# Altium schematic sheet Sheet1.SchDoc
size A3
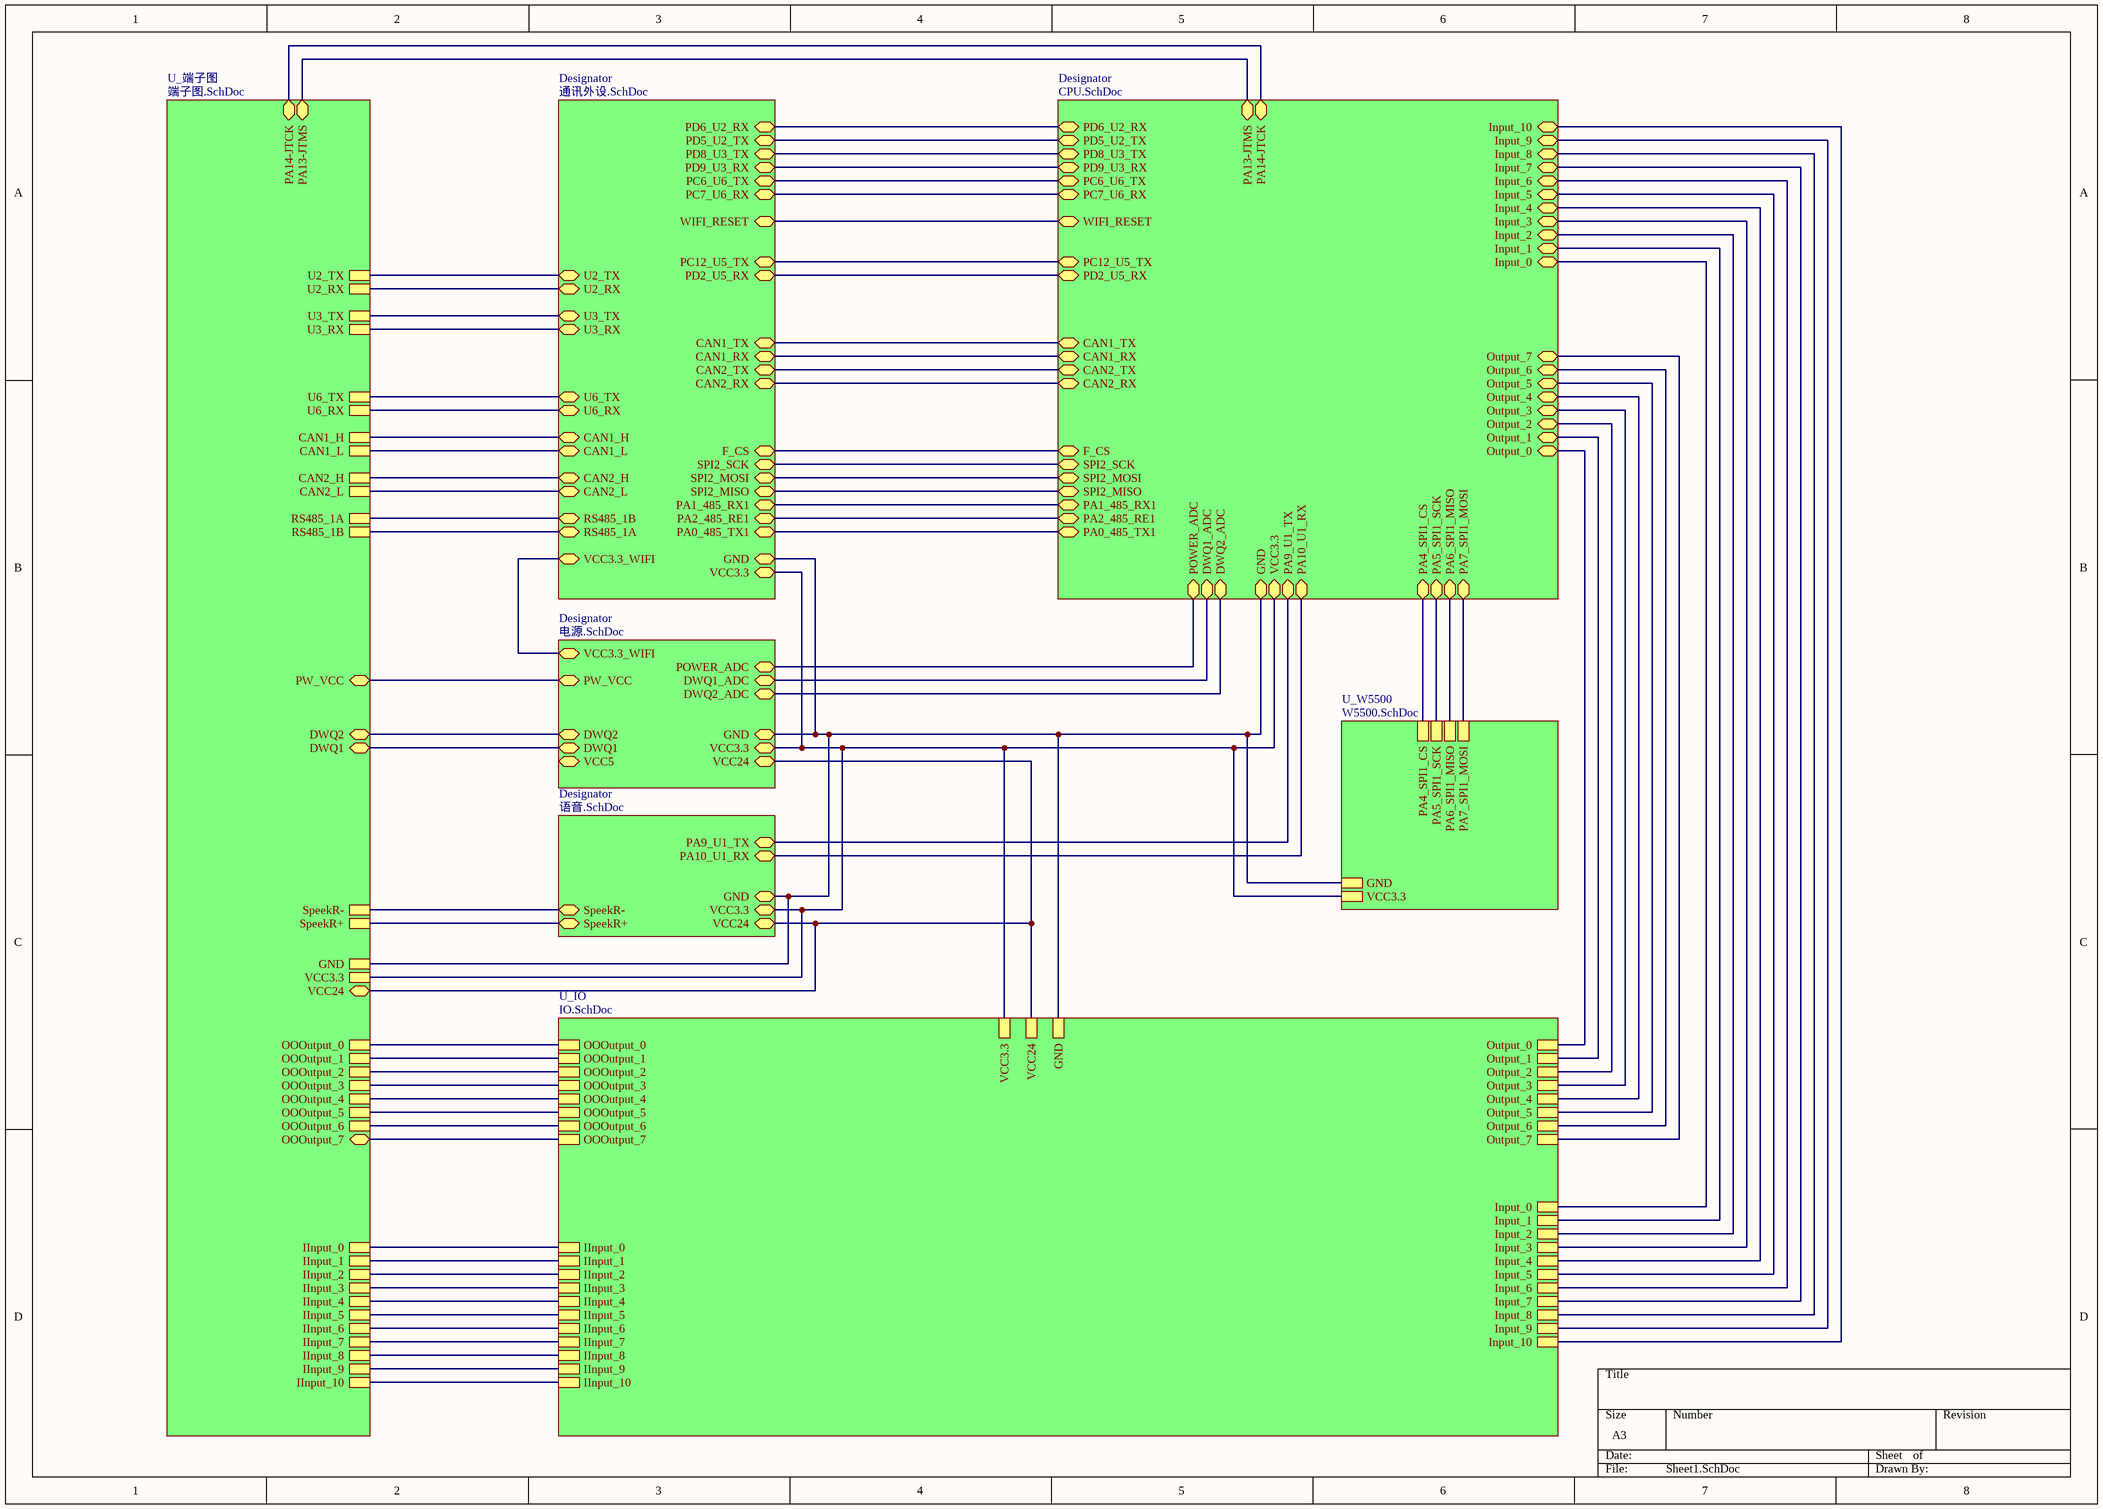
[diagram p0: Sheet1.SchDoc]

## Sub-sheets
Designator = CPU.SchDoc: PD8_U3_TX, PD9_U3_RX, PD5_U2_TX, PD6_U2_RX, PD2_U5_RX, PC12_U5_TX, PC6_U6_TX, PC7_U6_RX, DWQ1_ADC, DWQ2_ADC, SPI2_SCK, SPI2_MISO, SPI2_MOSI, F_CS, CAN2_RX, CAN2_TX, CAN1_RX, CAN1_TX, PA0_485_TX1, PA1_485_RX1, PA2_485_RE1, PA9_U1_TX, PA10_U1_RX, VCC3.3, GND, POWER_ADC, Input_0, Input_1, Input_2, Input_3, Input_4, Input_5, Input_6, Input_7, Input_8, Input_9, Input_10, Output_0, Output_1, Output_2, Output_3, Output_4, Output_5, Output_6, Output_7, PA4_SPI1_CS, PA5_SPI1_SCK, PA6_SPI1_MISO, PA7_SPI1_MOSI, PA13-JTMS, PA14-JTCK, WIFI_RESET
Designator = 通讯外设.SchDoc: PD6_U2_RX, PD5_U2_TX, PD8_U3_TX, PD9_U3_RX, PC6_U6_TX, PC7_U6_RX, U2_TX, U2_RX, U3_TX, U3_RX, PC12_U5_TX, PD2_U5_RX, U6_TX, U6_RX, CAN1_TX, CAN1_RX, CAN2_TX, CAN2_RX, CAN1_H, CAN1_L, CAN2_H, CAN2_L, F_CS, SPI2_SCK, SPI2_MOSI, SPI2_MISO, PA1_485_RX1, PA2_485_RE1, PA0_485_TX1, RS485_1B, RS485_1A, VCC3.3, GND, VCC3.3_WIFI, WIFI_RESET
Designator = 语音.SchDoc: SpeekR-, SpeekR+, PA9_U1_TX, PA10_U1_RX, VCC3.3, VCC24, GND
Designator = 电源.SchDoc: VCC3.3, VCC24, VCC5, GND, DWQ1_ADC, DWQ2_ADC, DWQ1, DWQ2, POWER_ADC, PW_VCC, VCC3.3_WIFI
U_IO = IO.SchDoc: VCC3.3, VCC24, GND, Input_0, Input_1, Input_2, Input_3, Input_4, Input_5, Input_6, Input_7, Input_8, Input_9, Input_10, IInput_0, IInput_1, IInput_2, IInput_3, IInput_4, IInput_5, IInput_6, IInput_7, IInput_8, IInput_9, IInput_10, Output_0, Output_1, Output_2, Output_3, Output_4, Output_5, Output_6, Output_7, OOOutput_0, OOOutput_1, OOOutput_2, OOOutput_3, OOOutput_4, OOOutput_5, OOOutput_6, OOOutput_7
U_W5500 = W5500.SchDoc: PA4_SPI1_CS, PA5_SPI1_SCK, PA6_SPI1_MISO, PA7_SPI1_MOSI, VCC3.3, GND
U_端子图 = 端子图.SchDoc: SpeekR-, SpeekR+, RS485_1B, RS485_1A, CAN1_H, CAN1_L, CAN2_H, CAN2_L, U2_TX, U2_RX, U3_TX, U3_RX, U6_TX, U6_RX, IInput_0, IInput_1, IInput_2, IInput_3, IInput_4, IInput_5, IInput_6, IInput_7, IInput_8, IInput_9, IInput_10, OOOutput_0, OOOutput_1, OOOutput_2, OOOutput_3, OOOutput_4, OOOutput_5, OOOutput_6, GND, VCC3.3, DWQ1, DWQ2, PA13-JTMS, PA14-JTCK, OOOutput_7, PW_VCC, VCC24

## Nets
(unnamed): sheet Designator/PD8_U3_TX, sheet Designator/PD8_U3_TX
(unnamed): sheet Designator/PD9_U3_RX, sheet Designator/PD9_U3_RX
(unnamed): sheet Designator/PD5_U2_TX, sheet Designator/PD5_U2_TX
(unnamed): sheet Designator/PD6_U2_RX, sheet Designator/PD6_U2_RX
(unnamed): sheet Designator/PD2_U5_RX, sheet Designator/PD2_U5_RX
(unnamed): sheet Designator/PC12_U5_TX, sheet Designator/PC12_U5_TX
(unnamed): sheet Designator/PC6_U6_TX, sheet Designator/PC6_U6_TX
(unnamed): sheet Designator/PC7_U6_RX, sheet Designator/PC7_U6_RX
(unnamed): sheet Designator/DWQ1_ADC, sheet Designator/DWQ1_ADC
(unnamed): sheet Designator/DWQ2_ADC, sheet Designator/DWQ2_ADC
(unnamed): sheet Designator/SPI2_SCK, sheet Designator/SPI2_SCK
(unnamed): sheet Designator/SPI2_MISO, sheet Designator/SPI2_MISO
(unnamed): sheet Designator/SPI2_MOSI, sheet Designator/SPI2_MOSI
(unnamed): sheet Designator/F_CS, sheet Designator/F_CS
(unnamed): sheet Designator/CAN2_RX, sheet Designator/CAN2_RX
(unnamed): sheet Designator/CAN2_TX, sheet Designator/CAN2_TX
(unnamed): sheet Designator/CAN1_RX, sheet Designator/CAN1_RX
(unnamed): sheet Designator/CAN1_TX, sheet Designator/CAN1_TX
(unnamed): sheet Designator/PA0_485_TX1, sheet Designator/PA0_485_TX1
(unnamed): sheet Designator/PA1_485_RX1, sheet Designator/PA1_485_RX1
(unnamed): sheet Designator/PA2_485_RE1, sheet Designator/PA2_485_RE1
(unnamed): sheet Designator/PA9_U1_TX, sheet Designator/PA9_U1_TX
(unnamed): sheet Designator/PA10_U1_RX, sheet Designator/PA10_U1_RX
(unnamed): sheet Designator/VCC3.3, sheet Designator/VCC3.3, sheet Designator/VCC3.3, sheet Designator/VCC3.3, sheet U_W5500/VCC3.3, sheet U_IO/VCC3.3, sheet U_端子图/VCC3.3
(unnamed): sheet Designator/GND, sheet Designator/GND, sheet Designator/GND, sheet Designator/GND, sheet U_W5500/GND, sheet U_IO/GND, sheet U_端子图/GND
(unnamed): sheet Designator/POWER_ADC, sheet Designator/POWER_ADC
(unnamed): sheet Designator/Input_0, sheet U_IO/Input_0
(unnamed): sheet Designator/Input_1, sheet U_IO/Input_1
(unnamed): sheet Designator/Input_2, sheet U_IO/Input_2
(unnamed): sheet Designator/Input_3, sheet U_IO/Input_3
(unnamed): sheet Designator/Input_4, sheet U_IO/Input_4
(unnamed): sheet Designator/Input_5, sheet U_IO/Input_5
(unnamed): sheet Designator/Input_6, sheet U_IO/Input_6
(unnamed): sheet Designator/Input_7, sheet U_IO/Input_7
(unnamed): sheet Designator/Input_8, sheet U_IO/Input_8
(unnamed): sheet Designator/Input_9, sheet U_IO/Input_9
(unnamed): sheet Designator/Input_10, sheet U_IO/Input_10
(unnamed): sheet Designator/Output_0, sheet U_IO/Output_0
(unnamed): sheet Designator/Output_1, sheet U_IO/Output_1
(unnamed): sheet Designator/Output_2, sheet U_IO/Output_2
(unnamed): sheet Designator/Output_3, sheet U_IO/Output_3
(unnamed): sheet Designator/Output_4, sheet U_IO/Output_4
(unnamed): sheet Designator/Output_5, sheet U_IO/Output_5
(unnamed): sheet Designator/Output_6, sheet U_IO/Output_6
(unnamed): sheet Designator/Output_7, sheet U_IO/Output_7
(unnamed): sheet Designator/PA4_SPI1_CS, sheet U_W5500/PA4_SPI1_CS
(unnamed): sheet Designator/PA5_SPI1_SCK, sheet U_W5500/PA5_SPI1_SCK
(unnamed): sheet Designator/PA6_SPI1_MISO, sheet U_W5500/PA6_SPI1_MISO
(unnamed): sheet Designator/PA7_SPI1_MOSI, sheet U_W5500/PA7_SPI1_MOSI
(unnamed): sheet Designator/PA13-JTMS, sheet U_端子图/PA13-JTMS
(unnamed): sheet Designator/PA14-JTCK, sheet U_端子图/PA14-JTCK
(unnamed): sheet Designator/WIFI_RESET, sheet Designator/WIFI_RESET
(unnamed): sheet Designator/U2_TX, sheet U_端子图/U2_TX
(unnamed): sheet Designator/U2_RX, sheet U_端子图/U2_RX
(unnamed): sheet Designator/U3_TX, sheet U_端子图/U3_TX
(unnamed): sheet Designator/U3_RX, sheet U_端子图/U3_RX
(unnamed): sheet Designator/U6_TX, sheet U_端子图/U6_TX
(unnamed): sheet Designator/U6_RX, sheet U_端子图/U6_RX
(unnamed): sheet Designator/CAN1_H, sheet U_端子图/CAN1_H
(unnamed): sheet Designator/CAN1_L, sheet U_端子图/CAN1_L
(unnamed): sheet Designator/CAN2_H, sheet U_端子图/CAN2_H
(unnamed): sheet Designator/CAN2_L, sheet U_端子图/CAN2_L
(unnamed): sheet Designator/RS485_1B, sheet U_端子图/RS485_1A
(unnamed): sheet Designator/RS485_1A, sheet U_端子图/RS485_1B
(unnamed): sheet Designator/VCC3.3_WIFI, sheet Designator/VCC3.3_WIFI
(unnamed): sheet Designator/SpeekR-, sheet U_端子图/SpeekR-
(unnamed): sheet Designator/SpeekR+, sheet U_端子图/SpeekR+
(unnamed): sheet Designator/VCC24, sheet Designator/VCC24, sheet U_IO/VCC24, sheet U_端子图/VCC24
(unnamed): sheet Designator/DWQ1, sheet U_端子图/DWQ1
(unnamed): sheet Designator/DWQ2, sheet U_端子图/DWQ2
(unnamed): sheet Designator/PW_VCC, sheet U_端子图/PW_VCC
(unnamed): sheet U_IO/IInput_0, sheet U_端子图/IInput_0
(unnamed): sheet U_IO/IInput_1, sheet U_端子图/IInput_1
(unnamed): sheet U_IO/IInput_2, sheet U_端子图/IInput_2
(unnamed): sheet U_IO/IInput_3, sheet U_端子图/IInput_3
(unnamed): sheet U_IO/IInput_4, sheet U_端子图/IInput_4
(unnamed): sheet U_IO/IInput_5, sheet U_端子图/IInput_5
(unnamed): sheet U_IO/IInput_6, sheet U_端子图/IInput_6
(unnamed): sheet U_IO/IInput_7, sheet U_端子图/IInput_7
(unnamed): sheet U_IO/IInput_8, sheet U_端子图/IInput_8
(unnamed): sheet U_IO/IInput_9, sheet U_端子图/IInput_9
(unnamed): sheet U_IO/IInput_10, sheet U_端子图/IInput_10
(unnamed): sheet U_IO/OOOutput_0, sheet U_端子图/OOOutput_0
(unnamed): sheet U_IO/OOOutput_1, sheet U_端子图/OOOutput_1
(unnamed): sheet U_IO/OOOutput_2, sheet U_端子图/OOOutput_2
(unnamed): sheet U_IO/OOOutput_3, sheet U_端子图/OOOutput_3
(unnamed): sheet U_IO/OOOutput_4, sheet U_端子图/OOOutput_4
(unnamed): sheet U_IO/OOOutput_5, sheet U_端子图/OOOutput_5
(unnamed): sheet U_IO/OOOutput_6, sheet U_端子图/OOOutput_6
(unnamed): sheet U_IO/OOOutput_7, sheet U_端子图/OOOutput_7